# Altium schematic sheet STM32F4.SchDoc
size A
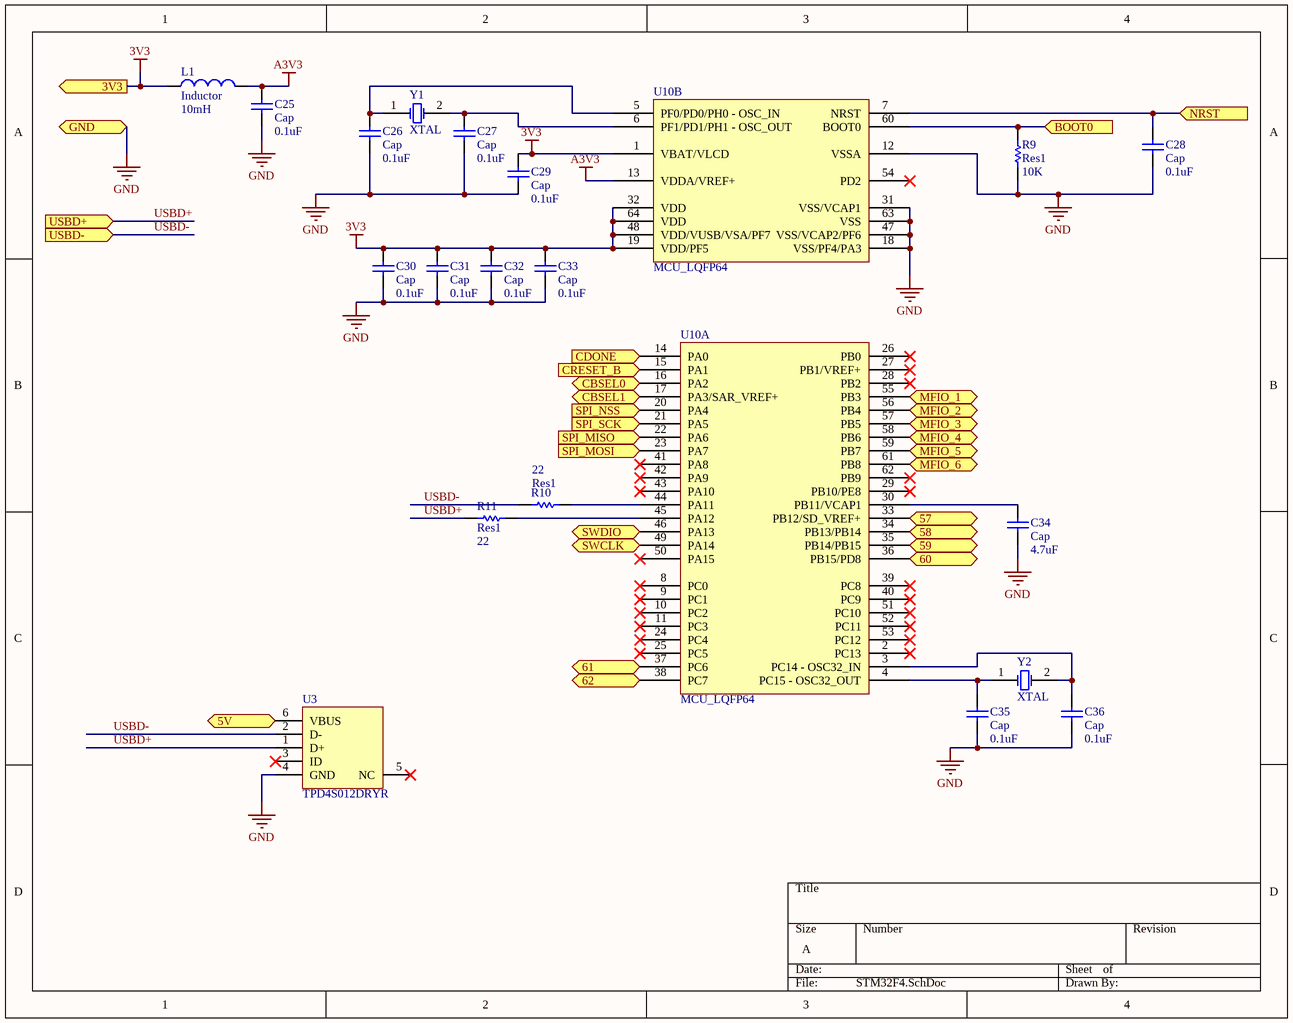
[diagram p0: STM32F4.SchDoc]

## Parts
C25  Cap  value 0.1uF  [RAD-0.3]
C26  Cap  value 0.1uF  [RAD-0.3]
C27  Cap  value 0.1uF  [RAD-0.3]
C28  Cap  value 0.1uF  [RAD-0.3]
C29  Cap  value 0.1uF  [RAD-0.3]
C30  Cap  value 0.1uF  [RAD-0.3]
C31  Cap  value 0.1uF  [RAD-0.3]
C32  Cap  value 0.1uF  [RAD-0.3]
C33  Cap  value 0.1uF  [RAD-0.3]
C34  Cap  value 4.7uF  [RAD-0.3]
C35  Cap  value 0.1uF  [RAD-0.3]
C36  Cap  value 0.1uF  [RAD-0.3]
L1  Inductor  value 10mH  [0402-A]
R9  Res1  value 10K  [AXIAL-0.3]
R10  Res1  value 22  [AXIAL-0.3]
R11  Res1  value 22  [AXIAL-0.3]
U3  TPD4S012DRYR  [DRY6]
U10  MCU_LQFP64  [STM-LQFP64_M]  (parts A,B of 2)
Y1  XTAL  [R38]
Y2  XTAL  [R38]

## Ports
3V3, 5V, 57 (bidir), 58 (bidir), 59 (bidir), 60 (bidir), 61 (bidir), 62 (bidir), BOOT0 (in), CBSEL0 (bidir), CBSEL1 (bidir), CDONE (in), CRESET_B (out), GND, MFIO_1 (bidir), MFIO_2 (bidir), MFIO_3 (bidir), MFIO_4 (bidir), MFIO_5 (bidir), MFIO_6 (bidir), NRST (in), SPI_MISO (in), SPI_MOSI (out), SPI_NSS (out), SPI_SCK (out), SWCLK (in), SWDIO (in), USBD+ (in), USBD- (in)

## Nets
3V3: C29.1 C30.1 C31.1 C32.1 C33.1 L1.1 U10.1(VBAT/VLCD) U10.19(VDD/PF5) U10.32(VDD) U10.48(VDD/VUSB/VSA/PF7) U10.64(VDD) ; port 3V3
A3V3: C25.1 L1.2 U10.13(VDDA/VREF+)
GND: C25.2 C26.2 C27.2 C28.2 C29.2 C30.2 C31.2 C32.2 C33.2 C34.2 C35.2 C36.2 R9.1 U3.4(GND) U10.12(VSSA) U10.18(VSS/PF4/PA3) U10.31(VSS/VCAP1) U10.47(VSS/VCAP2/PF6) U10.63(VSS) ; port GND
5V: U3.6(VBUS) ; port 5V
57: U10.33(PB12/SD_VREF+) ; port 57
58: U10.34(PB13/PB14) ; port 58
59: U10.35(PB14/PB15) ; port 59
60: U10.36(PB15/PD8) ; port 60
61: U10.37(PC6) ; port 61
62: U10.38(PC7) ; port 62
BOOT0: R9.2 U10.60(BOOT0) ; port BOOT0
CBSEL0: U10.16(PA2) ; port CBSEL0
CBSEL1: U10.17(PA3/SAR_VREF+) ; port CBSEL1
CDONE: U10.14(PA0) ; port CDONE
CRESET_B: U10.15(PA1) ; port CRESET_B
MFIO_1: U10.55(PB3) ; port MFIO_1
MFIO_2: U10.56(PB4) ; port MFIO_2
MFIO_3: U10.57(PB5) ; port MFIO_3
MFIO_4: U10.58(PB6) ; port MFIO_4
MFIO_5: U10.59(PB7) ; port MFIO_5
MFIO_6: U10.61(PB8) ; port MFIO_6
NRST: C28.1 U10.7(NRST) ; port NRST
SPI_MISO: U10.22(PA6) ; port SPI_MISO
SPI_MOSI: U10.23(PA7) ; port SPI_MOSI
SPI_NSS: U10.20(PA4) ; port SPI_NSS
SPI_SCK: U10.21(PA5) ; port SPI_SCK
SWCLK: U10.49(PA14) ; port SWCLK
SWDIO: U10.46(PA13) ; port SWDIO
USBD+: R11.2 U3.1(D+) ; port USBD+
USBD-: R10.2 U3.2(D-) ; port USBD-
NetC26_1: C26.1 U10.5(PF0/PD0/PH0_-_OSC_IN) Y1.1(OSC1)
NetC27_1: C27.1 U10.6(PF1/PD1/PH1_-_OSC_OUT) Y1.2(OSC2)
NetC34_1: C34.1 U10.30(PB11/VCAP1)
NetC35_1: C35.1 U10.4(PC15_-_OSC32_OUT) Y2.1(OSC1)
NetC36_1: C36.1 U10.3(PC14_-_OSC32_IN) Y2.2(OSC2)
NetR10_1: R10.1 U10.44(PA11)
NetR11_1: R11.1 U10.45(PA12)

Not connected (* = marked no-connect by the designer): U3 3(ID)* 5(NC)*; U10 2(PC13)* 8(PC0)* 9(PC1)* 10(PC2)* 11(PC3)* 24(PC4)* 25(PC5)* 26(PB0)* 27(PB1/VREF+)* 28(PB2)* 29(PB10/PE8)* 39(PC8)* 40(PC9)* 41(PA8)* 42(PA9)* 43(PA10)* 50(PA15)* 51(PC10)* 52(PC11)* 53(PC12)* 54(PD2)* 62(PB9)*

## Library data of the parts
C25-C36 = Cap: Capacitor; Published: 8-Jun-2000; LatestRevisionDate: 17-Jul-2002; LatestRevisionNote: Re-released for DXP Platform.; PackageReference: RAD-0.3; Publisher: Altium Limited; PackageDescription: Radial Cap, Thru-Hole; 2 Leads; 0.3 in Pin Spacing
L1 = Inductor: Code_IEC: 1005; Published: 8-Jun-2000; LatestRevisionDate: 29-May-2009; LatestRevisionNote: IPC-7351 Footprint Added.; PackageReference: 0402-A; Publisher: Altium Limited; PackageDescription: Chip Inductor; Code_JEITA: 0402
R9-R11 = Res1: Resistor; Published: 8-Jun-2000; LatestRevisionDate: 17-Jul-2002; LatestRevisionNote: Re-released for DXP Platform.; PackageReference: AXIAL-0.3; Publisher: Altium Limited; PackageDescription: Axial Device, Thru-Hole; 2 Leads; 0.3 in Pin Spacing
U3 = TPD4S012DRYR: USB ESD Solution with Power Clamp, 4 Channels, -40 to +85 degC, 6-pin SON (DRY), Green (RoHS & no Sb/Br); Manufacturer: Texas Instruments; Breakdown Voltage(Min)(V): 6; IEC 61000-4-2 Air-Gap(+/- kV): 10; IO Capacitance(Typ)(pF): 0.8; USB High Speed: TRUE; DatasheetVersion: SLVS928A; PackageVersion: revF, Dec-2011; PackageReference: DRY6; PackageDescription: 6-Pin Plastic Small Outline No-Lead, 1 x 1.45 x 0.6 mm Body, 0.5 mm Pitch; Supplier 1: Digi-Key; Supplier Part Number 1: 296-24244-2-ND; Supplier 2: Digi-Key; Supplier Part Number 2: 296-24244-1-ND; Supplier 3: Digi-Key; Supplier Part Number 3: 296-24244-6-ND; Supplier 4: Farnell; Supplier Part Number 4: 1755332; Supplier 5: Newark; Supplier Part Number 5: 73P5280; Supplier 6: Mouser; Supplier Part Number 6: 595-TPD4S012DRYR; Eco-Plan: Green (RoHS & no Sb/Br); IEC 61000-4-2 Contact(+/- kV): 10; IO Leakage Current(nA): 10; SubFamily: ESD Solution; Mounting Technology: Surface Mount; PartNumber: TPD4S012DRYR; ComponentLink1Description: Datasheet; ComponentLink1URL: http://www.ti.com/general/docs/lit/getliterature.tsp?genericPartNumber=TPD4S012&fileType=pdf; ComponentLink2Description: URL Link1; ComponentLink2URL: SamplesURL:http://www.ti.com/product/tpd4s012#samples
Y1 Y2 = XTAL: Crystal Oscillator; Published: 8-Jun-2000; LatestRevisionDate: 17-Jul-2002; LatestRevisionNote: Re-released for DXP Platform.; PackageReference: R38; Publisher: Altium Limited; PackageDescription: Crystal, Thru-Hole; 2 Leads; Body 3.1 x 8.2 mm (Dia.xH)